# Altium project TG21_TX_Ma tran phimPrjPcb.PrjPcb
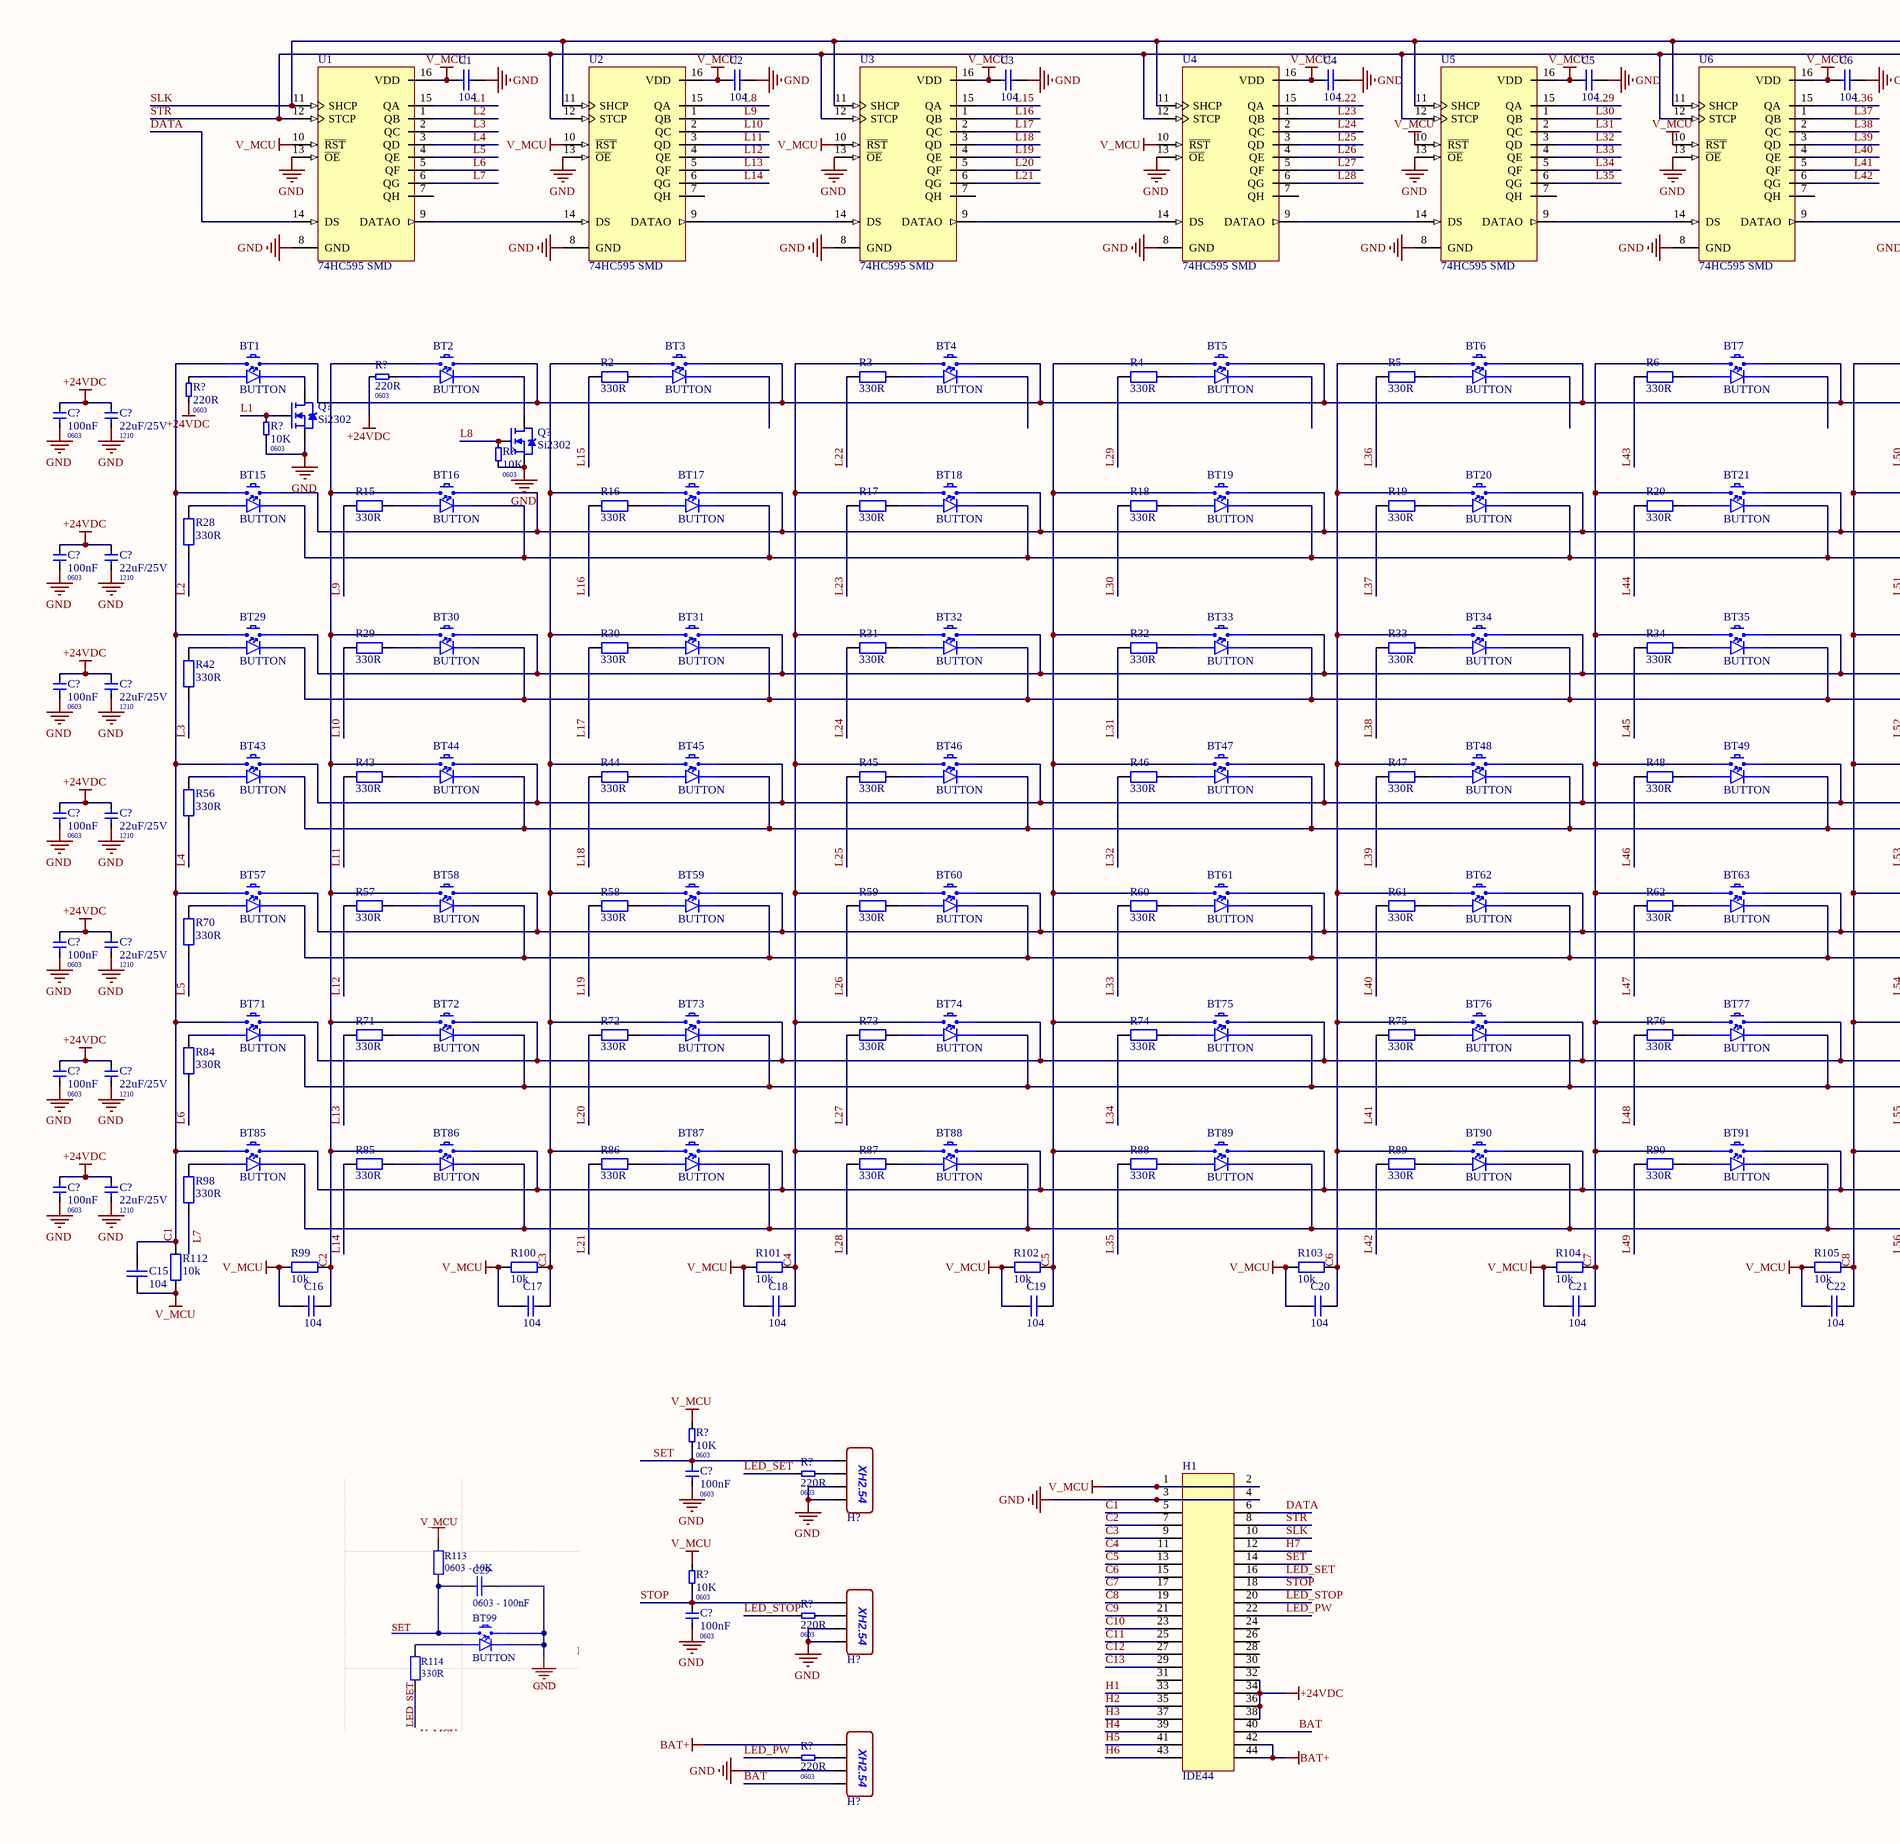
[diagram p0: TG21_TX_Ma tran phim.SchDoc, left]
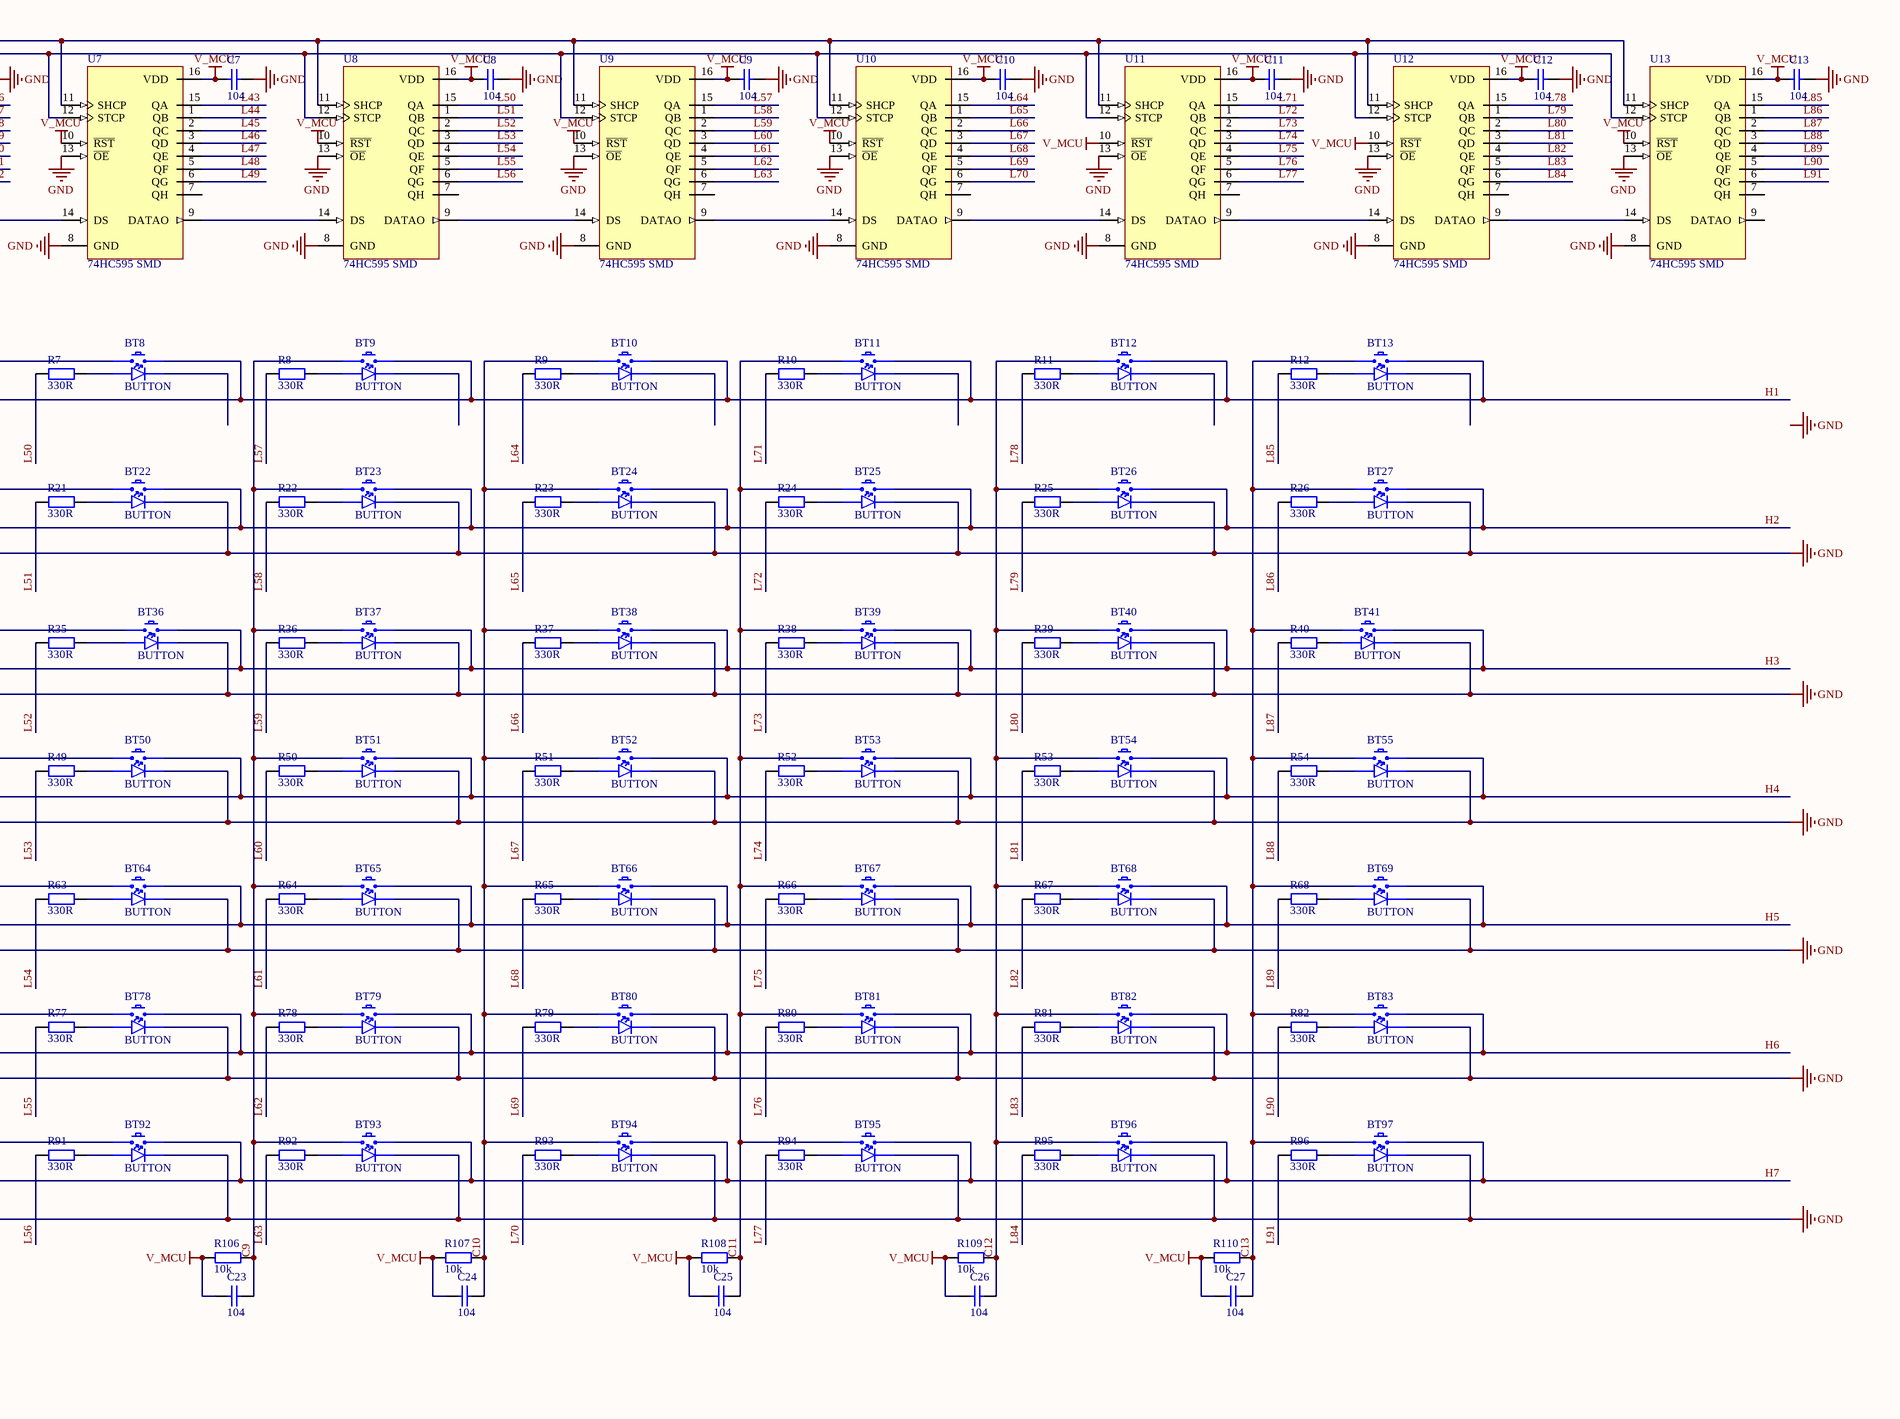
[diagram p1: TG21_TX_Ma tran phim.SchDoc, right]
1 sheet, 263 parts. Net scope: global (net labels, ports and power ports of the same name join across sheets).
Board file: TG21_TX_Ma tran phim.PcbDoc

## Sheet TG21_TX_Ma tran phim.SchDoc
size A1; SheetNumber: 1; SheetTotal: 1

### Parts
(Parts that share a designator on the sheet are numbered #1, #2 ... from top to bottom, then left to right.)
BT1  BUTTON  [Metal Push Button Switch]
BT2  BUTTON  [Metal Push Button Switch]
BT3  BUTTON  [Metal Push Button Switch]
BT4  BUTTON  [Metal Push Button Switch]
BT5  BUTTON  [Metal Push Button Switch]
BT6  BUTTON  [Metal Push Button Switch]
BT7  BUTTON  [Metal Push Button Switch]
BT8  BUTTON  [Metal Push Button Switch]
BT9  BUTTON  [Metal Push Button Switch]
BT10  BUTTON  [Metal Push Button Switch]
BT11  BUTTON  [Metal Push Button Switch]
BT12  BUTTON  [Metal Push Button Switch]
BT13  BUTTON  [Metal Push Button Switch]
BT15  BUTTON  [Metal Push Button Switch]
BT16  BUTTON  [Metal Push Button Switch]
BT17  BUTTON  [Metal Push Button Switch]
BT18  BUTTON  [Metal Push Button Switch]
BT19  BUTTON  [Metal Push Button Switch]
BT20  BUTTON  [Metal Push Button Switch]
BT21  BUTTON  [Metal Push Button Switch]
BT22  BUTTON  [Metal Push Button Switch]
BT23  BUTTON  [Metal Push Button Switch]
BT24  BUTTON  [Metal Push Button Switch]
BT25  BUTTON  [Metal Push Button Switch]
BT26  BUTTON  [Metal Push Button Switch]
BT27  BUTTON  [Metal Push Button Switch]
BT29  BUTTON  [Metal Push Button Switch]
BT30  BUTTON  [Metal Push Button Switch]
BT31  BUTTON  [Metal Push Button Switch]
BT32  BUTTON  [Metal Push Button Switch]
BT33  BUTTON  [Metal Push Button Switch]
BT34  BUTTON  [Metal Push Button Switch]
BT35  BUTTON  [Metal Push Button Switch]
BT36  BUTTON  [Metal Push Button Switch]
BT37  BUTTON  [Metal Push Button Switch]
BT38  BUTTON  [Metal Push Button Switch]
BT39  BUTTON  [Metal Push Button Switch]
BT40  BUTTON  [Metal Push Button Switch]
BT41  BUTTON  [Metal Push Button Switch]
BT43  BUTTON  [Metal Push Button Switch]
BT44  BUTTON  [Metal Push Button Switch]
BT45  BUTTON  [Metal Push Button Switch]
BT46  BUTTON  [Metal Push Button Switch]
BT47  BUTTON  [Metal Push Button Switch]
BT48  BUTTON  [Metal Push Button Switch]
BT49  BUTTON  [Metal Push Button Switch]
BT50  BUTTON  [Metal Push Button Switch]
BT51  BUTTON  [Metal Push Button Switch]
BT52  BUTTON  [Metal Push Button Switch]
BT53  BUTTON  [Metal Push Button Switch]
BT54  BUTTON  [Metal Push Button Switch]
BT55  BUTTON  [Metal Push Button Switch]
BT57  BUTTON  [Metal Push Button Switch]
BT58  BUTTON  [Metal Push Button Switch]
BT59  BUTTON  [Metal Push Button Switch]
BT60  BUTTON  [Metal Push Button Switch]
BT61  BUTTON  [Metal Push Button Switch]
BT62  BUTTON  [Metal Push Button Switch]
BT63  BUTTON  [Metal Push Button Switch]
BT64  BUTTON  [Metal Push Button Switch]
BT65  BUTTON  [Metal Push Button Switch]
BT66  BUTTON  [Metal Push Button Switch]
BT67  BUTTON  [Metal Push Button Switch]
BT68  BUTTON  [Metal Push Button Switch]
BT69  BUTTON  [Metal Push Button Switch]
BT71  BUTTON  [Metal Push Button Switch]
BT72  BUTTON  [Metal Push Button Switch]
BT73  BUTTON  [Metal Push Button Switch]
BT74  BUTTON  [Metal Push Button Switch]
BT75  BUTTON  [Metal Push Button Switch]
BT76  BUTTON  [Metal Push Button Switch]
BT77  BUTTON  [Metal Push Button Switch]
BT78  BUTTON  [Metal Push Button Switch]
BT79  BUTTON  [Metal Push Button Switch]
BT80  BUTTON  [Metal Push Button Switch]
BT81  BUTTON  [Metal Push Button Switch]
BT82  BUTTON  [Metal Push Button Switch]
BT83  BUTTON  [Metal Push Button Switch]
BT85  BUTTON  [Metal Push Button Switch]
BT86  BUTTON  [Metal Push Button Switch]
BT87  BUTTON  [Metal Push Button Switch]
BT88  BUTTON  [Metal Push Button Switch]
BT89  BUTTON  [Metal Push Button Switch]
BT90  BUTTON  [Metal Push Button Switch]
BT91  BUTTON  [Metal Push Button Switch]
BT92  BUTTON  [Metal Push Button Switch]
BT93  BUTTON  [Metal Push Button Switch]
BT94  BUTTON  [Metal Push Button Switch]
BT95  BUTTON  [Metal Push Button Switch]
BT96  BUTTON  [Metal Push Button Switch]
BT97  BUTTON  [Metal Push Button Switch]
C1  104  [tu 0603]
C2  104  [tu 0603]
C3  104  [tu 0603]
C4  104  [tu 0603]
C5  104  [tu 0603]
C6  104  [tu 0603]
C7  104  [tu 0603]
C8  104  [tu 0603]
C9  104  [tu 0603]
C10  104  [tu 0603]
C11  104  [tu 0603]
C12  104  [tu 0603]
C13  104  [tu 0603]
C15  104  [tu 0603]
C16  104  [tu 0603]
C17  104  [tu 0603]
C18  104  [tu 0603]
C19  104  [tu 0603]
C20  104  [tu 0603]
C21  104  [tu 0603]
C22  104  [tu 0603]
C23  104  [tu 0603]
C24  104  [tu 0603]
C25  104  [tu 0603]
C26  104  [tu 0603]
C27  104  [tu 0603]
C?#1  100nF  Package: 0603  [0603 MLCC]
C?#2  22uF/25V  Package: 1210  [1210 CAPACITOR]
C?#3  100nF  Package: 0603  [0603 MLCC]
C?#4  22uF/25V  Package: 1210  [1210 CAPACITOR]
C?#5  100nF  Package: 0603  [0603 MLCC]
C?#6  22uF/25V  Package: 1210  [1210 CAPACITOR]
C?#7  100nF  Package: 0603  [0603 MLCC]
C?#8  22uF/25V  Package: 1210  [1210 CAPACITOR]
C?#9  100nF  Package: 0603  [0603 MLCC]
C?#10  22uF/25V  Package: 1210  [1210 CAPACITOR]
C?#11  100nF  Package: 0603  [0603 MLCC]
C?#12  22uF/25V  Package: 1210  [1210 CAPACITOR]
C?#13  100nF  Package: 0603  [0603 MLCC]
C?#14  22uF/25V  Package: 1210  [1210 CAPACITOR]
C?#15  100nF  Package: 0603  [0603 MLCC]
C?#16  100nF  Package: 0603  [0603 MLCC]
H1  IDE44  [IDE]
H?#1  XY-XH2.54-4PZZ  [XH2.54 - 4PZZ]  (value not drawn)
H?#2  XY-XH2.54-4PZZ  [XH2.54 - 4PZZ]  (value not drawn)
H?#3  XY-XH2.54-4PZZ  [XH2.54 - 4PZZ]  (value not drawn)
Q?#1  Si2302  [SOT23_HVT]
Q?#2  Si2302  [SOT23_HVT]
R2  330R  [RES-0603-2]
R3  330R  [RES-0603-2]
R4  330R  [RES-0603-2]
R5  330R  [RES-0603-2]
R6  330R  [RES-0603-2]
R7  330R  [RES-0603-2]
R8  330R  [RES-0603-2]
R9  330R  [RES-0603-2]
R10  330R  [RES-0603-2]
R11  330R  [RES-0603-2]
R12  330R  [RES-0603-2]
R15  330R  [RES-0603-2]
R16  330R  [RES-0603-2]
R17  330R  [RES-0603-2]
R18  330R  [RES-0603-2]
R19  330R  [RES-0603-2]
R20  330R  [RES-0603-2]
R21  330R  [RES-0603-2]
R22  330R  [RES-0603-2]
R23  330R  [RES-0603-2]
R24  330R  [RES-0603-2]
R25  330R  [RES-0603-2]
R26  330R  [RES-0603-2]
R28  330R  [RES-0603-2]
R29  330R  [RES-0603-2]
R30  330R  [RES-0603-2]
R31  330R  [RES-0603-2]
R32  330R  [RES-0603-2]
R33  330R  [RES-0603-2]
R34  330R  [RES-0603-2]
R35  330R  [RES-0603-2]
R36  330R  [RES-0603-2]
R37  330R  [RES-0603-2]
R38  330R  [RES-0603-2]
R39  330R  [RES-0603-2]
R40  330R  [RES-0603-2]
R42  330R  [RES-0603-2]
R43  330R  [RES-0603-2]
R44  330R  [RES-0603-2]
R45  330R  [RES-0603-2]
R46  330R  [RES-0603-2]
R47  330R  [RES-0603-2]
R48  330R  [RES-0603-2]
R49  330R  [RES-0603-2]
R50  330R  [RES-0603-2]
R51  330R  [RES-0603-2]
R52  330R  [RES-0603-2]
R53  330R  [RES-0603-2]
R54  330R  [RES-0603-2]
R56  330R  [RES-0603-2]
R57  330R  [RES-0603-2]
R58  330R  [RES-0603-2]
R59  330R  [RES-0603-2]
R60  330R  [RES-0603-2]
R61  330R  [RES-0603-2]
R62  330R  [RES-0603-2]
R63  330R  [RES-0603-2]
R64  330R  [RES-0603-2]
R65  330R  [RES-0603-2]
R66  330R  [RES-0603-2]
R67  330R  [RES-0603-2]
R68  330R  [RES-0603-2]
R70  330R  [RES-0603-2]
R71  330R  [RES-0603-2]
R72  330R  [RES-0603-2]
R73  330R  [RES-0603-2]
R74  330R  [RES-0603-2]
R75  330R  [RES-0603-2]
R76  330R  [RES-0603-2]
R77  330R  [RES-0603-2]
R78  330R  [RES-0603-2]
R79  330R  [RES-0603-2]
R80  330R  [RES-0603-2]
R81  330R  [RES-0603-2]
R82  330R  [RES-0603-2]
R84  330R  [RES-0603-2]
R85  330R  [RES-0603-2]
R86  330R  [RES-0603-2]
R87  330R  [RES-0603-2]
R88  330R  [RES-0603-2]
R89  330R  [RES-0603-2]
R90  330R  [RES-0603-2]
R91  330R  [RES-0603-2]
R92  330R  [RES-0603-2]
R93  330R  [RES-0603-2]
R94  330R  [RES-0603-2]
R95  330R  [RES-0603-2]
R96  330R  [RES-0603-2]
R98  330R  [RES-0603-2]
R99  10k  [tro smd 0603]
R100  10k  [tro smd 0603]
R101  10k  [tro smd 0603]
R102  10k  [tro smd 0603]
R103  10k  [tro smd 0603]
R104  10k  [tro smd 0603]
R105  10k  [tro smd 0603]
R106  10k  [tro smd 0603]
R107  10k  [tro smd 0603]
R108  10k  [tro smd 0603]
R109  10k  [tro smd 0603]
R110  10k  [tro smd 0603]
R112  10k  [tro smd 0603]
R?#1  220R  Package: 0603  [0603 Resistors]
R?#2  220R  Package: 0603  [0603 Resistors]
R?#3  10K  Package: 0603  [0603 Resistors]
R?#4  10K  Package: 0603  [0603 Resistors]
R?#5  10K  Package: 0603  [0603 Resistors]
R?#6  220R  Package: 0603  [0603 Resistors]
R?#7  10K  Package: 0603  [0603 Resistors]
R?#8  220R  Package: 0603  [0603 Resistors]
R?#9  220R  Package: 0603  [0603 Resistors]
U1  74HC595 SMD  [SOP 16]
U2  74HC595 SMD  [SOP 16]
U3  74HC595 SMD  [SOP 16]
U4  74HC595 SMD  [SOP 16]
U5  74HC595 SMD  [SOP 16]
U6  74HC595 SMD  [SOP 16]
U7  74HC595 SMD  [SOP 16]
U8  74HC595 SMD  [SOP 16]
U9  74HC595 SMD  [SOP 16]
U10  74HC595 SMD  [SOP 16]
U11  74HC595 SMD  [SOP 16]
U12  74HC595 SMD  [SOP 16]
U13  74HC595 SMD  [SOP 16]

### Nets
+24VDC: C?#1.2 C?#2.2 C?#3.2 C?#4.2 C?#5.2 C?#6.2 C?#7.2 C?#8.2 C?#9.2 C?#10.2 C?#11.2 C?#12.2 C?#13.2 C?#14.2 H1.32 H1.34 H1.36 H1.38 R?#1.2 R?#2.1
BAT+: H1.42 H1.44 H?#3.4
GND: BT15.4 BT16.4 BT17.4 BT18.4 BT19.4 BT20.4 BT21.4 BT22.4 BT23.4 BT24.4 BT25.4 BT26.4 BT27.4 BT29.4 BT30.4 BT31.4 BT32.4 BT33.4 BT34.4 BT35.4 BT36.4 BT37.4 BT38.4 BT39.4 BT40.4 BT41.4 BT43.4 BT44.4 BT45.4 BT46.4 BT47.4 BT48.4 BT49.4 BT50.4 BT51.4 BT52.4 BT53.4 BT54.4 BT55.4 BT57.4 BT58.4 BT59.4 BT60.4 BT61.4 BT62.4 BT63.4 BT64.4 BT65.4 BT66.4 BT67.4 BT68.4 BT69.4 BT71.4 BT72.4 BT73.4 BT74.4 BT75.4 BT76.4 BT77.4 BT78.4 BT79.4 BT80.4 BT81.4 BT82.4 BT83.4 BT85.4 BT86.4 BT87.4 BT88.4 BT89.4 BT90.4 BT91.4 BT92.4 BT93.4 BT94.4 BT95.4 BT96.4 BT97.4 C1.1 C2.1 C3.1 C4.1 C5.1 C6.1 C7.1 C8.1 C9.1 C10.1 C11.1 C12.1 C13.1 C?#1.1 C?#2.1 C?#3.1 C?#4.1 C?#5.1 C?#6.1 C?#7.1 C?#8.1 C?#9.1 C?#10.1 C?#11.1 C?#12.1 C?#13.1 C?#14.1 C?#15.2 C?#16.2 H1.3 H1.4 H?#1.1 H?#1.2 H?#2.1 H?#2.2 H?#3.2 Q?#1.2(S) Q?#2.2(S) R?#3.1 R?#4.1 U1.8(GND) U1.13(~{OE}) U2.8(GND) U2.13(~{OE}) U3.8(GND) U3.13(~{OE}) U4.8(GND) U4.13(~{OE}) U5.8(GND) U5.13(~{OE}) U6.8(GND) U6.13(~{OE}) U7.8(GND) U7.13(~{OE}) U8.8(GND) U8.13(~{OE}) U9.8(GND) U9.13(~{OE}) U10.8(GND) U10.13(~{OE}) U11.8(GND) U11.13(~{OE}) U12.8(GND) U12.13(~{OE}) U13.8(GND) U13.13(~{OE})
V_MCU: C1.2 C2.2 C3.2 C4.2 C5.2 C6.2 C7.2 C8.2 C9.2 C10.2 C11.2 C12.2 C13.2 C15.2 C16.2 C17.2 C18.2 C19.2 C20.2 C21.2 C22.2 C23.2 C24.2 C25.2 C26.2 C27.2 H1.1 H1.2 R99.1 R100.1 R101.1 R102.1 R103.1 R104.1 R105.1 R106.1 R107.1 R108.1 R109.1 R110.1 R112.1 R?#5.2 R?#7.2 U1.10(~{RST}) U1.16(VDD) U2.10(~{RST}) U2.16(VDD) U3.10(~{RST}) U3.16(VDD) U4.10(~{RST}) U4.16(VDD) U5.10(~{RST}) U5.16(VDD) U6.10(~{RST}) U6.16(VDD) U7.10(~{RST}) U7.16(VDD) U8.10(~{RST}) U8.16(VDD) U9.10(~{RST}) U9.16(VDD) U10.10(~{RST}) U10.16(VDD) U11.10(~{RST}) U11.16(VDD) U12.10(~{RST}) U12.16(VDD) U13.10(~{RST}) U13.16(VDD)
BAT: H1.40 H?#3.1
C1: BT1.1 BT15.1 BT29.1 BT43.1 BT57.1 BT71.1 BT85.1 C15.1 H1.5 R112.2
C2: BT2.1 BT16.1 BT30.1 BT44.1 BT58.1 BT72.1 BT86.1 C16.1 H1.7 R99.2
C3: BT3.1 BT17.1 BT31.1 BT45.1 BT59.1 BT73.1 BT87.1 C17.1 H1.9 R100.2
C4: BT4.1 BT18.1 BT32.1 BT46.1 BT60.1 BT74.1 BT88.1 C18.1 H1.11 R101.2
C5: BT5.1 BT19.1 BT33.1 BT47.1 BT61.1 BT75.1 BT89.1 C19.1 H1.13 R102.2
C6: BT6.1 BT20.1 BT34.1 BT48.1 BT62.1 BT76.1 BT90.1 C20.1 H1.15 R103.2
C7: BT7.1 BT21.1 BT35.1 BT49.1 BT63.1 BT77.1 BT91.1 C21.1 H1.17 R104.2
C8: BT8.1 BT22.1 BT36.1 BT50.1 BT64.1 BT78.1 BT92.1 C22.1 H1.19 R105.2
C9: BT9.1 BT23.1 BT37.1 BT51.1 BT65.1 BT79.1 BT93.1 C23.1 H1.21 R106.2
C10: BT10.1 BT24.1 BT38.1 BT52.1 BT66.1 BT80.1 BT94.1 C24.1 H1.23 R107.2
C11: BT11.1 BT25.1 BT39.1 BT53.1 BT67.1 BT81.1 BT95.1 C25.1 H1.25 R108.2
C12: BT12.1 BT26.1 BT40.1 BT54.1 BT68.1 BT82.1 BT96.1 C26.1 H1.27 R109.2
C13: BT13.1 BT27.1 BT41.1 BT55.1 BT69.1 BT83.1 BT97.1 C27.1 H1.29 R110.2
DATA: H1.6 U1.14(DS)
H1: BT1.2 BT2.2 BT3.2 BT4.2 BT5.2 BT6.2 BT7.2 BT8.2 BT9.2 BT10.2 BT11.2 BT12.2 BT13.2 H1.33
H2: BT15.2 BT16.2 BT17.2 BT18.2 BT19.2 BT20.2 BT21.2 BT22.2 BT23.2 BT24.2 BT25.2 BT26.2 BT27.2 H1.35
H3: BT29.2 BT30.2 BT31.2 BT32.2 BT33.2 BT34.2 BT35.2 BT36.2 BT37.2 BT38.2 BT39.2 BT40.2 BT41.2 H1.37
H4: BT43.2 BT44.2 BT45.2 BT46.2 BT47.2 BT48.2 BT49.2 BT50.2 BT51.2 BT52.2 BT53.2 BT54.2 BT55.2 H1.39
H5: BT57.2 BT58.2 BT59.2 BT60.2 BT61.2 BT62.2 BT63.2 BT64.2 BT65.2 BT66.2 BT67.2 BT68.2 BT69.2 H1.41
H6: BT71.2 BT72.2 BT73.2 BT74.2 BT75.2 BT76.2 BT77.2 BT78.2 BT79.2 BT80.2 BT81.2 BT82.2 BT83.2 H1.43
H7: BT85.2 BT86.2 BT87.2 BT88.2 BT89.2 BT90.2 BT91.2 BT92.2 BT93.2 BT94.2 BT95.2 BT96.2 BT97.2 H1.12
L1: Q?#1.1(G) R?#3.2 U1.15(QA)
L2: R28.1 U1.1(QB)
L3: R42.1 U1.2(QC)
L4: R56.1 U1.3(QD)
L5: R70.1 U1.4(QE)
L6: R84.1 U1.5(QF)
L7: R98.1 U1.6(QG)
L8: Q?#2.1(G) R?#4.2 U2.15(QA)
L9: R15.2 U2.1(QB)
L10: R29.2 U2.2(QC)
L11: R43.2 U2.3(QD)
L12: R57.2 U2.4(QE)
L13: R71.2 U2.5(QF)
L14: R85.2 U2.6(QG)
L15: R2.2 U3.15(QA)
L16: R16.2 U3.1(QB)
L17: R30.2 U3.2(QC)
L18: R44.2 U3.3(QD)
L19: R58.2 U3.4(QE)
L20: R72.2 U3.5(QF)
L21: R86.2 U3.6(QG)
L22: R3.2 U4.15(QA)
L23: R17.2 U4.1(QB)
L24: R31.2 U4.2(QC)
L25: R45.2 U4.3(QD)
L26: R59.2 U4.4(QE)
L27: R73.2 U4.5(QF)
L28: R87.2 U4.6(QG)
L29: R4.2 U5.15(QA)
L30: R18.2 U5.1(QB)
L31: R32.2 U5.2(QC)
L32: R46.2 U5.3(QD)
L33: R60.2 U5.4(QE)
L34: R74.2 U5.5(QF)
L35: R88.2 U5.6(QG)
L36: R5.2 U6.15(QA)
L37: R19.2 U6.1(QB)
L38: R33.2 U6.2(QC)
L39: R47.2 U6.3(QD)
L40: R61.2 U6.4(QE)
L41: R75.2 U6.5(QF)
L42: R89.2 U6.6(QG)
L43: R6.2 U7.15(QA)
L44: R20.2 U7.1(QB)
L45: R34.2 U7.2(QC)
L46: R48.2 U7.3(QD)
L47: R62.2 U7.4(QE)
L48: R76.2 U7.5(QF)
L49: R90.2 U7.6(QG)
L50: R7.2 U8.15(QA)
L51: R21.2 U8.1(QB)
L52: R35.2 U8.2(QC)
L53: R49.2 U8.3(QD)
L54: R63.2 U8.4(QE)
L55: R77.2 U8.5(QF)
L56: R91.2 U8.6(QG)
L57: R8.2 U9.15(QA)
L58: R22.2 U9.1(QB)
L59: R36.2 U9.2(QC)
L60: R50.2 U9.3(QD)
L61: R64.2 U9.4(QE)
L62: R78.2 U9.5(QF)
L63: R92.2 U9.6(QG)
L64: R9.2 U10.15(QA)
L65: R23.2 U10.1(QB)
L66: R37.2 U10.2(QC)
L67: R51.2 U10.3(QD)
L68: R65.2 U10.4(QE)
L69: R79.2 U10.5(QF)
L70: R93.2 U10.6(QG)
L71: R10.2 U11.15(QA)
L72: R24.2 U11.1(QB)
L73: R38.2 U11.2(QC)
L74: R52.2 U11.3(QD)
L75: R66.2 U11.4(QE)
L76: R80.2 U11.5(QF)
L77: R94.2 U11.6(QG)
L78: R11.2 U12.15(QA)
L79: R25.2 U12.1(QB)
L80: R39.2 U12.2(QC)
L81: R53.2 U12.3(QD)
L82: R67.2 U12.4(QE)
L83: R81.2 U12.5(QF)
L84: R95.2 U12.6(QG)
L85: R12.2 U13.15(QA)
L86: R26.2 U13.1(QB)
L87: R40.2 U13.2(QC)
L88: R54.2 U13.3(QD)
L89: R68.2 U13.4(QE)
L90: R82.2 U13.5(QF)
L91: R96.2 U13.6(QG)
LED_PW: H1.22 R?#9.1
LED_SET: H1.16 R?#6.1
LED_STOP: H1.20 R?#8.1
SET: C?#15.1 H1.14 H?#1.4 R?#5.1
SLK: H1.10 U1.11(SHCP) U2.11(SHCP) U3.11(SHCP) U4.11(SHCP) U5.11(SHCP) U6.11(SHCP) U7.11(SHCP) U8.11(SHCP) U9.11(SHCP) U10.11(SHCP) U11.11(SHCP) U12.11(SHCP) U13.11(SHCP)
STOP: C?#16.1 H1.18 H?#2.4 R?#7.1
STR: H1.8 U1.12(STCP) U2.12(STCP) U3.12(STCP) U4.12(STCP) U5.12(STCP) U6.12(STCP) U7.12(STCP) U8.12(STCP) U9.12(STCP) U10.12(STCP) U11.12(STCP) U12.12(STCP) U13.12(STCP)
NetBT1_3: BT1.3 R?#2.2
NetBT1_4: BT1.4 Q?#1.3(D)
NetBT2_3: BT2.3 R?#1.1
NetBT2_4: BT2.4 Q?#2.3(D)
NetBT3_3: BT3.3 R2.1
NetBT4_3: BT4.3 R3.1
NetBT5_3: BT5.3 R4.1
NetBT6_3: BT6.3 R5.1
NetBT7_3: BT7.3 R6.1
NetBT8_3: BT8.3 R7.1
NetBT9_3: BT9.3 R8.1
NetBT10_3: BT10.3 R9.1
NetBT11_3: BT11.3 R10.1
NetBT12_3: BT12.3 R11.1
NetBT13_3: BT13.3 R12.1
NetBT15_3: BT15.3 R28.2
NetBT16_3: BT16.3 R15.1
NetBT17_3: BT17.3 R16.1
NetBT18_3: BT18.3 R17.1
NetBT19_3: BT19.3 R18.1
NetBT20_3: BT20.3 R19.1
NetBT21_3: BT21.3 R20.1
NetBT22_3: BT22.3 R21.1
NetBT23_3: BT23.3 R22.1
NetBT24_3: BT24.3 R23.1
NetBT25_3: BT25.3 R24.1
NetBT26_3: BT26.3 R25.1
NetBT27_3: BT27.3 R26.1
NetBT29_3: BT29.3 R42.2
NetBT30_3: BT30.3 R29.1
NetBT31_3: BT31.3 R30.1
NetBT32_3: BT32.3 R31.1
NetBT33_3: BT33.3 R32.1
NetBT34_3: BT34.3 R33.1
NetBT35_3: BT35.3 R34.1
NetBT36_3: BT36.3 R35.1
NetBT37_3: BT37.3 R36.1
NetBT38_3: BT38.3 R37.1
NetBT39_3: BT39.3 R38.1
NetBT40_3: BT40.3 R39.1
NetBT41_3: BT41.3 R40.1
NetBT43_3: BT43.3 R56.2
NetBT44_3: BT44.3 R43.1
NetBT45_3: BT45.3 R44.1
NetBT46_3: BT46.3 R45.1
NetBT47_3: BT47.3 R46.1
NetBT48_3: BT48.3 R47.1
NetBT49_3: BT49.3 R48.1
NetBT50_3: BT50.3 R49.1
NetBT51_3: BT51.3 R50.1
NetBT52_3: BT52.3 R51.1
NetBT53_3: BT53.3 R52.1
NetBT54_3: BT54.3 R53.1
NetBT55_3: BT55.3 R54.1
NetBT57_3: BT57.3 R70.2
NetBT58_3: BT58.3 R57.1
NetBT59_3: BT59.3 R58.1
NetBT60_3: BT60.3 R59.1
NetBT61_3: BT61.3 R60.1
NetBT62_3: BT62.3 R61.1
NetBT63_3: BT63.3 R62.1
NetBT64_3: BT64.3 R63.1
NetBT65_3: BT65.3 R64.1
NetBT66_3: BT66.3 R65.1
NetBT67_3: BT67.3 R66.1
NetBT68_3: BT68.3 R67.1
NetBT69_3: BT69.3 R68.1
NetBT71_3: BT71.3 R84.2
NetBT72_3: BT72.3 R71.1
NetBT73_3: BT73.3 R72.1
NetBT74_3: BT74.3 R73.1
NetBT75_3: BT75.3 R74.1
NetBT76_3: BT76.3 R75.1
NetBT77_3: BT77.3 R76.1
NetBT78_3: BT78.3 R77.1
NetBT79_3: BT79.3 R78.1
NetBT80_3: BT80.3 R79.1
NetBT81_3: BT81.3 R80.1
NetBT82_3: BT82.3 R81.1
NetBT83_3: BT83.3 R82.1
NetBT85_3: BT85.3 R98.2
NetBT86_3: BT86.3 R85.1
NetBT87_3: BT87.3 R86.1
NetBT88_3: BT88.3 R87.1
NetBT89_3: BT89.3 R88.1
NetBT90_3: BT90.3 R89.1
NetBT91_3: BT91.3 R90.1
NetBT92_3: BT92.3 R91.1
NetBT93_3: BT93.3 R92.1
NetBT94_3: BT94.3 R93.1
NetBT95_3: BT95.3 R94.1
NetBT96_3: BT96.3 R95.1
NetBT97_3: BT97.3 R96.1
NetH?#1_3: H?#1.3 R?#6.2
NetH?#2_3: H?#2.3 R?#8.2
NetH?#3_3: H?#3.3 R?#9.2
NetU1_9: U1.9(DATAO) U2.14(DS)
NetU2_9: U2.9(DATAO) U3.14(DS)
NetU3_9: U3.9(DATAO) U4.14(DS)
NetU4_9: U4.9(DATAO) U5.14(DS)
NetU5_9: U5.9(DATAO) U6.14(DS)
NetU6_9: U6.9(DATAO) U7.14(DS)
NetU7_9: U7.9(DATAO) U8.14(DS)
NetU8_9: U8.9(DATAO) U9.14(DS)
NetU9_9: U9.9(DATAO) U10.14(DS)
NetU10_9: U10.9(DATAO) U11.14(DS)
NetU11_9: U11.9(DATAO) U12.14(DS)
NetU12_9: U12.9(DATAO) U13.14(DS)

Not connected (* = marked no-connect by the designer): BT3 4; BT4 4; BT5 4; BT6 4; BT7 4; BT8 4; BT9 4; BT10 4; BT11 4; BT12 4; BT13 4; H1 24 26 28 30 31; U1 7(QH); U2 7(QH); U3 7(QH); U4 7(QH); U5 7(QH); U6 7(QH); U7 7(QH); U8 7(QH); U9 7(QH); U10 7(QH); U11 7(QH); U12 7(QH); U13 7(QH) 9(DATAO)

### Notes on the sheet
- Labels drawn without touching a wire or pin: GND
- (in symbol XH2.54 4PZZ) XH2.54

### Library data of the parts
BT1-BT13 BT15-BT27 BT29-BT41 BT43-BT55 BT57-BT69 BT71-BT83 BT85-BT97 = Metal Push Button Switch: ComponentLink1Description: Link
C1-C13 C15-C27 = Tu 0603 104 50V 10%: Dán; Don_Vi: Con; So_Chan: 2; Ten_Linh_Kien: Tụ 0603 104-100nF 10% 50V; Ma_Hang: MH004568; Chung_Loai: Dán; Kieu_Chan: *
C?#1 C?#3 C?#5 C?#7 C?#9 C?#11 C?#13 C?#15 C?#16 = 0603 100nF: 100nF ±10% 50V Ceramic Capacitor X7R 0603; Manufacturer: YAGEO; Mfr. Part #: CC0603KRX7R9BB104; LCSC Part #: C14663; ComponentLink1Description: LCSC Link; ComponentLink1URL: https://www.lcsc.com/product-detail/C14663.html?s_z=n_0603%2520100nF
C?#2 C?#4 C?#6 C?#8 C?#10 C?#12 C?#14 = 1210 22uF 25V X7R: 22uF ±10% 25V Ceramic Capacitor X7R 1210; Manufacturer: Samsung Electro-Mechanics; Mfr. Part #: CL32B226KAJNNNE; LCSC Part #: C309062; ComponentLink1Description: LCSC Link; ComponentLink1URL: https://www.lcsc.com/product-detail/C309062.html?s_z=n_22uF%25201210
H?#1-H?#3 = XH2.54 4PZZ: XH 1 4P -25℃~+85℃ 2.54mm 4 2A 250V 1x4P Through Hole,P=2.54mm Headers, Male Pins RoHS; Manufacturer: XYECONN; Mfr. Part #: XY-XH2.54-4PZZ; LCSC Part #: C53201003; ComponentLink1Description: LCSC Link; ComponentLink1URL: https://www.lcsc.com/product-detail/C53201003.html?s_z=n_XH2.54%25204P; Package: Through Hole,P=2.54mm; Type: Header; Assembly Type: DIP Assembly; ComponentLink2Description: Datasheet; ComponentLink2URL: https://www.lcsc.com/datasheet/C53201003.pdf
Q?#1 Q?#2 = SI2302: N-Channel 20V 2.9A 0.55W Surface Mount SOT-23; Manufacturer: VISHAY; Mfr. Part #: Si2302CDS-T1-GE3; LCSC Part #: C10488; Package: SOT-23; ComponentLink1Description: LCSC Link; ComponentLink1URL: https://www.lcsc.com/product-detail/C10488.html?s_z=n_si2302
R2-R12 R15-R26 R28-R40 R42-R54 R56-R68 R70-R82 R84-R96 R98 = Tro 0603 5% 330R: Dán; Don_Vi: Con; Ma_Hang: MH006910; So_Chan: 2; Ten_Linh_Kien: Trở 0603 5% 330R; Chung_Loai: Dán; Kieu_Chan: *
R99-R110 R112 = Tro 0603 1% 10k: Dán; Don_Vi: Con; So_Chan: 2; Ten_Linh_Kien: Trở 0603 1% 10k; Ma_Hang: MH006333; Chung_Loai: Dán; Kieu_Chan: *
R?#1 R?#2 R?#6 R?#8 R?#9 = 0603 220R: 100mW 220Ω 75V Thick Film Resistor ±1% ±100ppm/℃ 0603 Chip Resistor - Surface Mount RoHS; Mfr. Part #: CRCW0603220RFKEAHP; Manufacturer: VISHAY; LCSC Part #: C313707; ComponentLink1Description: LCSC Link; ComponentLink1URL: https://www.lcsc.com/product-detail/C313707.html?s_z=n_0603%2520220R; Value: 220R
R?#3-R?#5 R?#7 = 0603 10K: 100mW 10kΩ 75V Thick Film Resistor ±1% ±100ppm/℃ 0603 Chip Resistor - Surface Mount RoHS; Manufacturer: VISHAY; Mfr. Part #: CRCW060310K0FKEA; LCSC Part #: C844918; ComponentLink1Description: LCSC Link; ComponentLink1URL: https://www.lcsc.com/product-detail/C844918.html?s_z=n_10K
U1-U13 = 74HC595 SMD: Dán; Ten_Linh_Kien: 74HC595D SOP16; Don_Vi: Con; Ma_Hang: MH000672; Ghi_Chu: *; Kieu_Chan: *; Chung_Loai: Dán